# EAGLE design FubarStep_v13 (EAGLE 7.7.0)
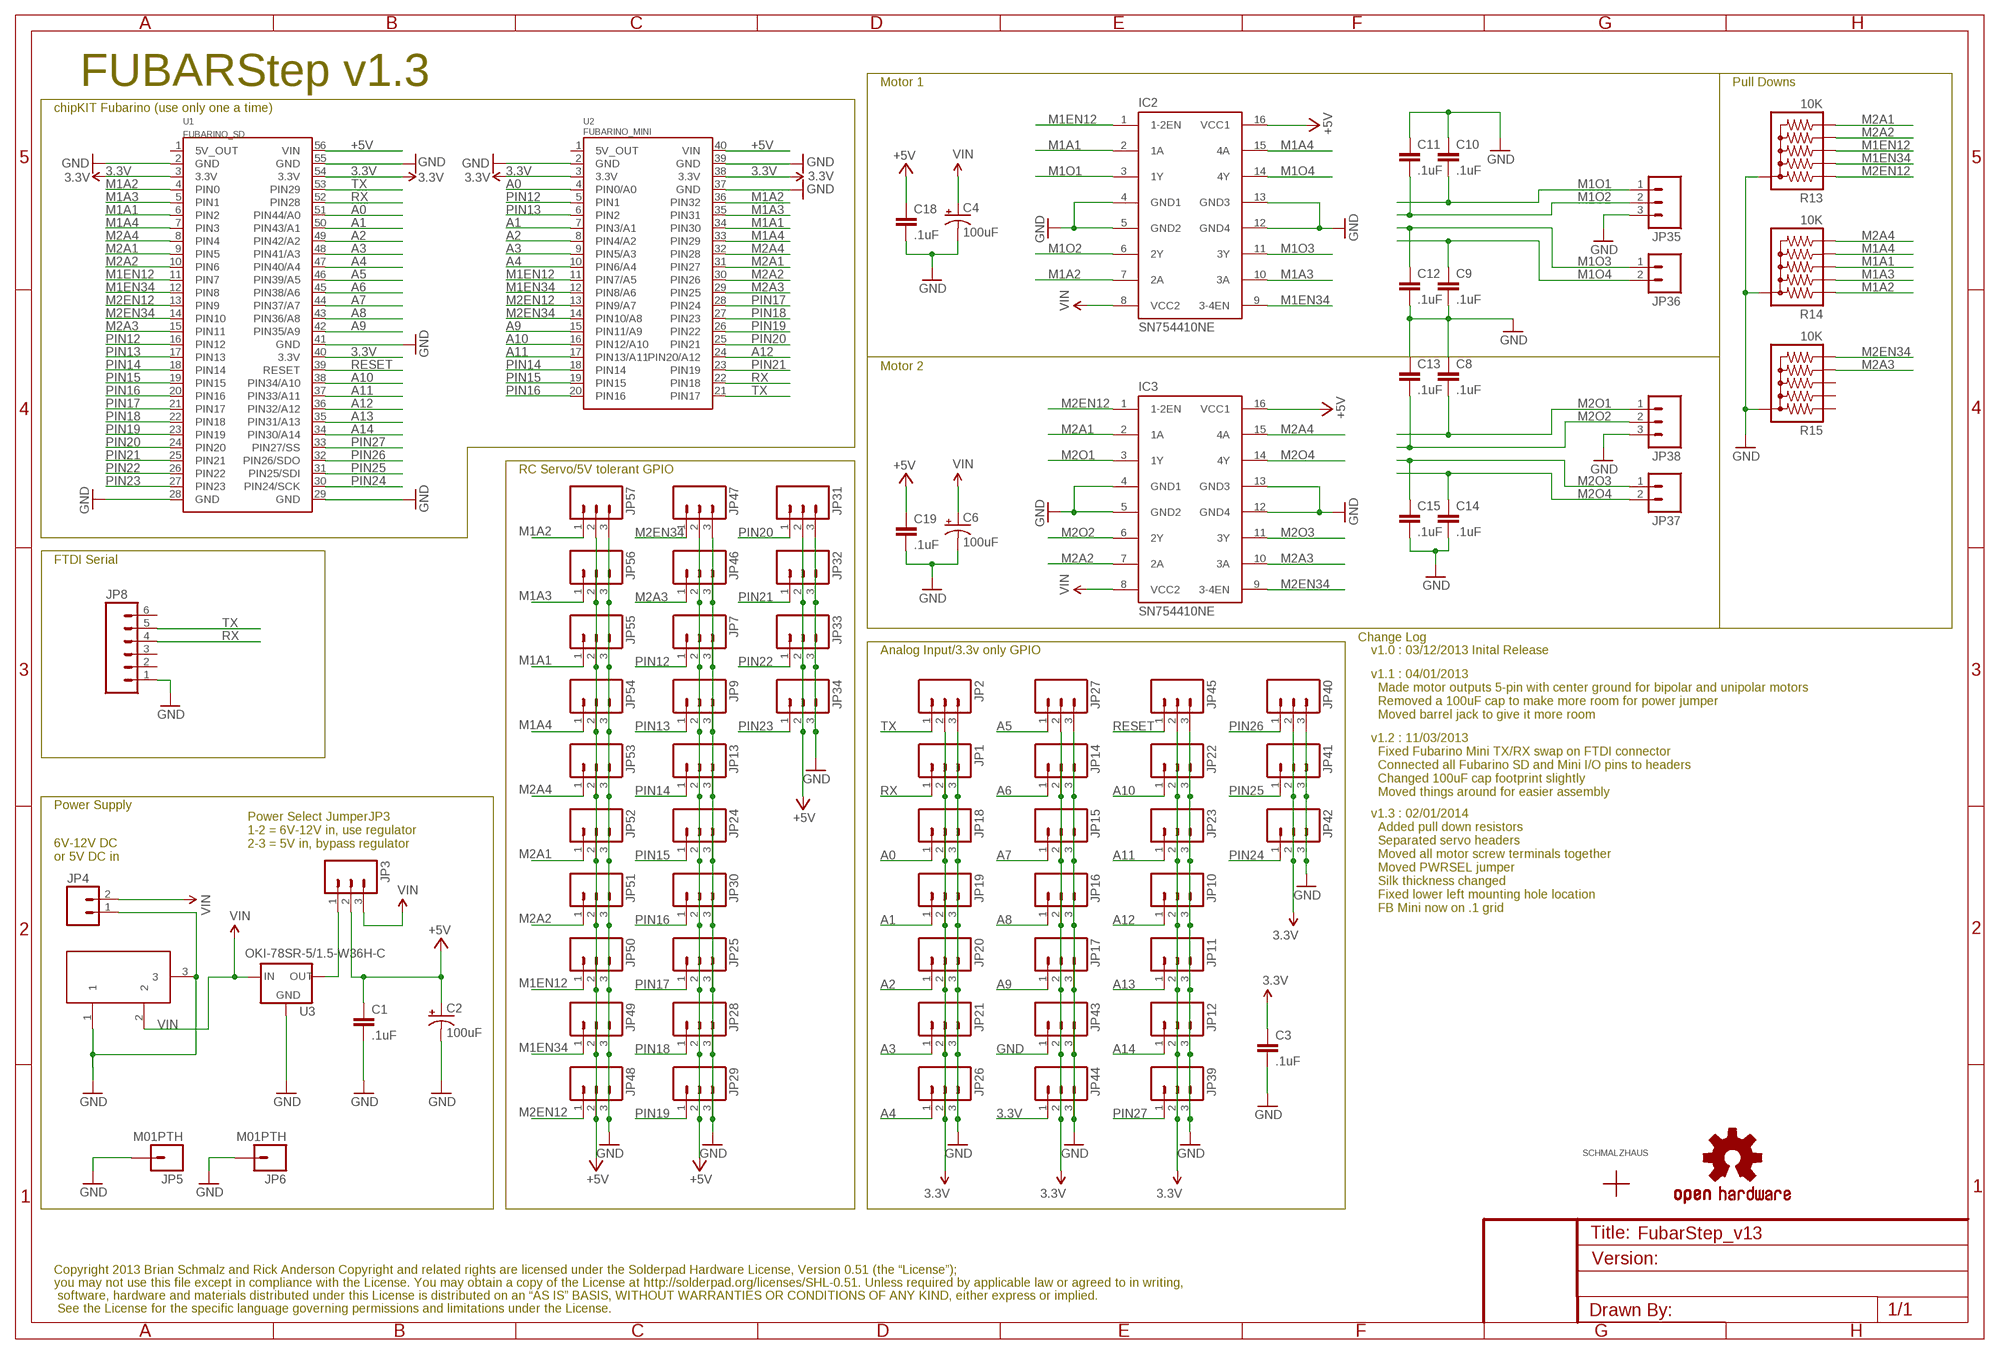
[diagram p0: schematic, sheet 1]

## Parts
C1  .1uF  CAPPTH  [CAP-PTH-SMALL]
C2  100uF  CAP_ELECTROLYTICPTH1_BPS  [CPOL-RADIAL-100UF]
C3  .1uF  CAPPTH  [CAP-PTH-SMALL]
C4  100uF  CAP_ELECTROLYTICPTH1_BPS  [CPOL-RADIAL-100UF]
C6  100uF  CAP_ELECTROLYTICPTH1_BPS  [CPOL-RADIAL-100UF]
C8  .1uF  CAPPTH  [CAP-PTH-SMALL]
C9  .1uF  CAPPTH  [CAP-PTH-SMALL]
C10  .1uF  CAPPTH  [CAP-PTH-SMALL]
C11  .1uF  CAPPTH  [CAP-PTH-SMALL]
C12  .1uF  CAPPTH  [CAP-PTH-SMALL]
C13  .1uF  CAPPTH  [CAP-PTH-SMALL]
C14  .1uF  CAPPTH  [CAP-PTH-SMALL]
C15  .1uF  CAPPTH  [CAP-PTH-SMALL]
C18  .1uF  CAPPTH  [CAP-PTH-SMALL]
C19  .1uF  CAPPTH  [CAP-PTH-SMALL]
IC2  SN754410NE  L293E  [DIL16]
IC3  SN754410NE  L293E  [DIL16]
JP1  M03PTH  [1X03]
JP2  M03PTH  [1X03]
JP3  M03PTH  [1X03]
JP4  M023.5MM  [SCREWTERMINAL-3.5MM-2]
JP5  M01PTH  [1X01]
JP6  M01PTH  [1X01]
JP7  M03PTH  [1X03]
JP8  M06LOCK  [1X06_LOCK]
JP9  M03PTH  [1X03]
JP10  M03PTH  [1X03]
JP11  M03PTH  [1X03]
JP12  M03PTH  [1X03]
JP13  M03PTH  [1X03]
JP14  M03PTH  [1X03]
JP15  M03PTH  [1X03]
JP16  M03PTH  [1X03]
JP17  M03PTH  [1X03]
JP18  M03PTH  [1X03]
JP19  M03PTH  [1X03]
JP20  M03PTH  [1X03]
JP21  M03PTH  [1X03]
JP22  M03PTH  [1X03]
JP23  M03PTH  [1X03]
JP24  M03PTH  [1X03]
JP25  M03PTH  [1X03]
JP26  M03PTH  [1X03]
JP27  M03PTH  [1X03]
JP28  M03PTH  [1X03]
JP29  M03PTH  [1X03]
JP30  M03PTH  [1X03]
JP31  M03PTH  [1X03]
JP32  M03PTH  [1X03]
JP33  M03PTH  [1X03]
JP34  M03PTH  [1X03]
JP35  M03SCREW  [SCREWTERMINAL-3.5MM-3]
JP36  M023.5MM  [SCREWTERMINAL-3.5MM-2]
JP37  M023.5MM  [SCREWTERMINAL-3.5MM-2]
JP38  M03SCREW  [SCREWTERMINAL-3.5MM-3]
JP39  M03PTH  [1X03]
JP40  M03PTH  [1X03]
JP41  M03PTH  [1X03]
JP42  M03PTH  [1X03]
JP43  M03PTH  [1X03]
JP44  M03PTH  [1X03]
JP45  M03PTH  [1X03]
JP46  M03PTH  [1X03]
JP47  M03PTH  [1X03]
JP48  M03PTH  [1X03]
JP49  M03PTH  [1X03]
JP50  M03PTH  [1X03]
JP51  M03PTH  [1X03]
JP52  M03PTH  [1X03]
JP53  M03PTH  [1X03]
JP54  M03PTH  [1X03]
JP55  M03PTH  [1X03]
JP56  M03PTH  [1X03]
JP57  M03PTH  [1X03]
LOGO1  OSHW-LOGOM  [OSHW-LOGO-M]
R13  10K  RPACK-BUSSED-SIP-PTH-5  [RPACK-SIP-PTH-5]
R14  10K  RPACK-BUSSED-SIP-PTH-5  [RPACK-SIP-PTH-5]
R15  10K  RPACK-BUSSED-SIP-PTH-5  [RPACK-SIP-PTH-5]
U1  FUBARINO_SD  [FUBARINO_SD]
U2  FUBARINO_MINI  [FUBARINO_MINI]
U3  OKI-78SR-5/1.5-W36H-C  V_REG_78XXSINK  [TO220-IGO]
U$1  SCHMALZHAUSSCHMALZHAUS_SMALL  [SCHMALZHAUS_SMALL]
X1  DC21MMX  [DC-21MM]

## Nets
3.3V: C3.1 JP1.2 JP2.2 JP10.2 JP11.2 JP12.2 JP14.2 JP15.2 JP16.2 JP17.2 JP18.2 JP19.2 JP20.2 JP21.2 JP22.2 JP23.2 JP26.2 JP27.2 JP39.2 JP40.2 JP41.2 JP42.2 JP43.2 JP44.1 JP44.2 JP45.2 U1.3(3.3V) U1.40(3.3V) U1.54(3.3V) U2.3(3.3V) U2.38(3.3V)
+5V: C1.1 C2.1(+) C18.1 C19.1 IC2.16(VCC1) IC3.16(VCC1) JP3.2 JP7.2 JP9.2 JP13.2 JP24.2 JP25.2 JP28.2 JP29.2 JP30.2 JP31.2 JP32.2 JP33.2 JP34.2 JP46.2 JP47.2 JP48.2 JP49.2 JP50.2 JP51.2 JP52.2 JP53.2 JP54.2 JP55.2 JP56.2 JP57.2 U1.56(VIN) U2.40(VIN)
A0: JP18.1 U1.51(PIN44/A0) U2.4(PIN0/A0)
A1: JP19.1 U1.50(PIN43/A1) U2.7(PIN3/A1)
A2: JP20.1 U1.49(PIN42/A2) U2.8(PIN4/A2)
A3: JP21.1 U1.48(PIN41/A3) U2.9(PIN5/A3)
A4: JP26.1 U1.47(PIN40/A4) U2.10(PIN6/A4)
A5: JP27.1 U1.46(PIN39/A5)
A6: JP14.1 U1.45(PIN38/A6)
A7: JP15.1 U1.44(PIN37/A7)
A8: JP16.1 U1.43(PIN36/A8)
A9: JP17.1 U1.42(PIN35/A9) U2.15(PIN11/A9)
A10: JP22.1 U1.38(PIN34/A10) U2.16(PIN12/A10)
A11: JP23.1 U1.37(PIN33/A11) U2.17(PIN13/A11)
A12: JP10.1 U1.36(PIN32/A12) U2.24(PIN20/A12)
A13: JP11.1 U1.35(PIN31/A13)
A14: JP12.1 U1.34(PIN30/A14)
GND: C1.2 C2.2(-) C3.2 C4.2(-) C6.2(-) C8.1 C9.2 C10.1 C11.1 C12.2 C13.1 C14.2 C15.2 C18.2 C19.2 IC2.4(GND1) IC2.5(GND2) IC2.12(GND4) IC2.13(GND3) IC3.4(GND1) IC3.5(GND2) IC3.12(GND4) IC3.13(GND3) JP1.3 JP2.3 JP4.1 JP5.1 JP6.1 JP7.3 JP8.1 JP9.3 JP10.3 JP11.3 JP12.3 JP13.3 JP14.3 JP15.3 JP16.3 JP17.3 JP18.3 JP19.3 JP20.3 JP21.3 JP22.3 JP23.3 JP24.3 JP25.3 JP26.3 JP27.3 JP28.3 JP29.3 JP30.3 JP31.3 JP32.3 JP33.3 JP34.3 JP35.3 JP38.3 JP39.3 JP40.3 JP41.3 JP42.3 JP43.1 JP43.3 JP44.3 JP45.3 JP46.3 JP47.3 JP48.3 JP49.3 JP50.3 JP51.3 JP52.3 JP53.3 JP54.3 JP55.3 JP56.3 JP57.3 R13.P$1 R14.P$1 R15.P$1 U1.2(GND) U1.28(GND) U1.29(GND) U1.41(GND) U1.55(GND) U2.2(GND) U2.37(GND) U2.39(GND) U3.GND X1.1 X1.3
M1A1: IC2.2(1A) JP55.1 R14.P$4 U1.6(PIN2) U2.34(PIN30)
M1A2: IC2.7(2A) JP57.1 R14.P$2 U1.4(PIN0) U2.36(PIN32)
M1A3: IC2.10(3A) JP56.1 R14.P$3 U1.5(PIN1) U2.35(PIN31)
M1A4: IC2.15(4A) JP54.1 R14.P$5 U1.7(PIN3) U2.33(PIN29)
M1EN12: IC2.1(1-2EN) JP50.1 R13.P$4 U1.11(PIN7) U2.11(PIN7/A5)
M1EN34: IC2.9(3-4EN) JP49.1 R13.P$3 U1.12(PIN8) U2.12(PIN8/A6)
M1O1: C10.2 IC2.3(1Y) JP35.1
M1O2: C11.2 IC2.6(2Y) JP35.2
M1O3: C12.1 IC2.11(3Y) JP36.1
M1O4: C9.1 IC2.14(4Y) JP36.2
M2A1: IC3.2(1A) JP52.1 R13.P$6 U1.9(PIN5) U2.31(PIN27)
M2A2: IC3.7(2A) JP51.1 R13.P$5 U1.10(PIN6) U2.30(PIN26)
M2A3: IC3.10(3A) JP46.1 R15.P$5 U1.15(PIN11) U2.29(PIN25)
M2A4: IC3.15(4A) JP53.1 R14.P$6 U1.8(PIN4) U2.32(PIN28)
M2EN12: IC3.1(1-2EN) JP48.1 R13.P$2 U1.13(PIN9) U2.13(PIN9/A7)
M2EN34: IC3.9(3-4EN) JP47.1 R15.P$6 U1.14(PIN10) U2.14(PIN10/A8)
M2O1: C8.2 IC3.3(1Y) JP38.1
M2O2: C13.2 IC3.6(2Y) JP38.2
M2O3: C15.1 IC3.11(3Y) JP37.1
M2O4: C14.1 IC3.14(4Y) JP37.2
N$2: JP3.1 U3.OUT
PIN12: JP7.1 U1.16(PIN12) U2.5(PIN1)
PIN13: JP9.1 U1.17(PIN13) U2.6(PIN2)
PIN14: JP13.1 U1.18(PIN14) U2.18(PIN14)
PIN15: JP24.1 U1.19(PIN15) U2.19(PIN15)
PIN16: JP30.1 U1.20(PIN16) U2.20(PIN16)
PIN17: JP25.1 U1.21(PIN17) U2.28(PIN24)
PIN18: JP28.1 U1.22(PIN18) U2.27(PIN23)
PIN19: JP29.1 U1.23(PIN19) U2.26(PIN22)
PIN20: JP31.1 U1.24(PIN20) U2.25(PIN21)
PIN21: JP32.1 U1.25(PIN21) U2.23(PIN19)
PIN22: JP33.1 U1.26(PIN22)
PIN23: JP34.1 U1.27(PIN23)
PIN24: JP42.1 U1.30(PIN24/SCK)
PIN25: JP41.1 U1.31(PIN25/SDI)
PIN26: JP40.1 U1.32(PIN26/SDO)
PIN27: JP39.1 U1.33(PIN27/SS)
RESET: JP45.1 U1.39(RESET)
RX: JP1.1 JP8.4 U1.52(PIN28) U2.22(PIN18)
TX: JP2.1 JP8.5 U1.53(PIN29) U2.21(PIN17)
VIN: C4.1(+) C6.1(+) IC2.8(VCC2) IC3.8(VCC2) JP3.3 JP4.2 U3.IN X1.2
Unconnected: JP8.2 JP8.3 JP8.6 R15.P$2 R15.P$3 R15.P$4 U1.1(5V_OUT) U2.1(5V_OUT)

## Notes on the sheet
- FUBARStep v1.3 | Motor 1 | Pull Downs
- chipKIT Fubarino (use only one a time)
- Motor 2
- RC Servo/5V tolerant GPIO
- FTDI Serial
- Change Log
- Analog Input/3.3v only GPIO | v1.0 : 03/12/2013 Inital Release
- v1.1 : 04/01/2013
    Made motor outputs 5-pin with center ground for bipolar and unipolar motors
    Removed a 100uF cap to make more room for power jumper
    Moved barrel jack to give it more room
- v1.2 : 11/03/2013
    Fixed Fubarino Mini TX/RX swap on FTDI connector
    Connected all Fubarino SD and Mini I/O pins to headers
    Changed 100uF cap footprint slightly
    Moved things around for easier assembly
- Power Supply
- Power Select JumperJP3
  1-2 = 6V-12V in, use regulator
  2-3 = 5V in, bypass regulator
- 6V-12V DC 
  or 5V DC in
- v1.3 : 02/01/2014
    Added pull down resistors
    Separated servo headers
    Moved all motor screw terminals together
    Moved PWRSEL jumper
    Silk thickness changed
    Fixed lower left mounting hole location
    FB Mini now on .1 grid
- Copyright 2013 Brian Schmalz and Rick Anderson Copyright and related rights are licensed under the Solderpad Hardware License, Version 0.51 (the “License”);
- you may not use this file except in compliance with the License. You may obtain a copy of the License at http://solderpad.org/licenses/SHL-0.51. Unless required by applicable law or agreed to in writing,
- software, hardware and materials distributed under this License is distributed on an “AS IS” BASIS, WITHOUT WARRANTIES OR CONDITIONS OF ANY KIND, either express or implied.
- See the License for the specific language governing permissions and limitations under the License.

## Library data of the parts
C1 C3 C8-C15 C18 C19 = SparkFun-Capacitors:CAP: Capacitor Standard 0603 ceramic capacitor, and 0.1" leaded capacitor.
C2 C4 C6 = SchmalzHaus:CAP_ELECTROLYTIC
IC2 IC3 = texas:L293E: TI DEVICE; MF: Arrow Electronics; MPN: L293E; OC_FARNELL: 1467711; OC_NEWARK: 89K0732
JP1-JP3 JP7 JP9-JP35 JP38-JP57 = SparkFun-Connectors:M03: Header 3 Standard 3-pin 0.1" header. Use with straight break away headers (SKU : PRT-00116), right angle break away headers (PRT-00553), swiss pins (PRT-00743), machine pins (PRT-00117), and female headers (PRT-00115). Molex polarized connector foot print use with SKU : PRT-08232 with associated crimp pins and housings.
JP4 JP36 JP37 = SparkFun-Connectors:M02: Header 2 Standard 2-pin 0.1" header. Use with straight break away headers (SKU : PRT-00116), right angle break away headers (PRT-00553), swiss pins (PRT-00743), machine pins (PRT-00117), and female headers (PRT-00115). Molex polarized connector foot print use with SKU : PRT-08233 with associated crimp pins and housings.
JP5 JP6 = SparkFun-Connectors:M01: Header 1 Standard 1-pin 0.1" header. Use with straight break away headers (SKU : PRT-00116), right angle break away headers (PRT-00553), swiss pins (PRT-00743), machine pins (PRT-00117), and female headers (PRT-00115).
JP8 = SparkFun-Connectors:M06: Header 6 Standard 6-pin 0.1" header. Use with straight break away headers (SKU : PRT-00116), right angle break away headers (PRT-00553), swiss pins (PRT-00743), machine pins (PRT-00117), and female headers (PRT-00115). Molex polarized connector foot print use with SKU : PRT-08094 with associated crimp pins and housings. NOTES ON THE VARIANTS LOCK and LOCK_LONGPADS... This footprint was designed to help hold the alignment of a through-hole component (i.e. 6-pin header) while soldering it into place. You may notice that each hole has been shifted either up or down by 0.005 of an inch from it's more standard position (which is a perfectly straight line). This slight alteration caused the pins (the squares in the middle) to touch the edges of the holes. Because they are alternating, it causes a "brace" to hold the component in place. 0.005 has proven to be the perfect amount of "off-center" position when using our standard breakaway headers. Although looks a little odd when you look at the bare footprint, once you have a header in there, the alteration is very hard to notice. Also, if you push a header all the way into place, it is covered up entirely on the bottom side. This idea of altering the position of holes to aid alignment will be further integrated into the Sparkfun Library for other footprints. It can help hold any component with 3 or more connection pins.
LOGO1 = SparkFun-Aesthetics:OSHW-LOGO: Open Source Hardware Logo This logo indicates the piece of hardware it is found on incorporates a OSHW license and/or adheres to the definition of open source hardware found here: http://freedomdefined.org/OSHW
R13-R15 = SparkFun-Resistors:RPACK: BOURNS 4600X series thick-film SIP resistor packs Five resistors bussed to a single pin (denoted by dot). 0.2W / resistor datasheet <http://dlnmh9ip6v2uc.cloudfront.net/datasheets/Components/General/4600x.pdf> SFE parts COM-10855 (330), COM-10856 (10K)
U1 = SchmalzHausPublic:FUBARINO_SD
U2 = SchmalzHausPublic:FUBARINO_MINI
U3 = SparkFun-PowerIC:V_REG_78XX: Voltage Regulator Standard 7805 5V regulator. IGO (Input Ground Output). Spark Fun Electronics SKU : COM-00107
U$1 = SchmalzHaus:SCHMALZHAUS
X1 = powersupply:DC21MM

## Net classes
0 default: width 0.152 mm, drill 0.305 mm, clearance 0.152 mm

## Board
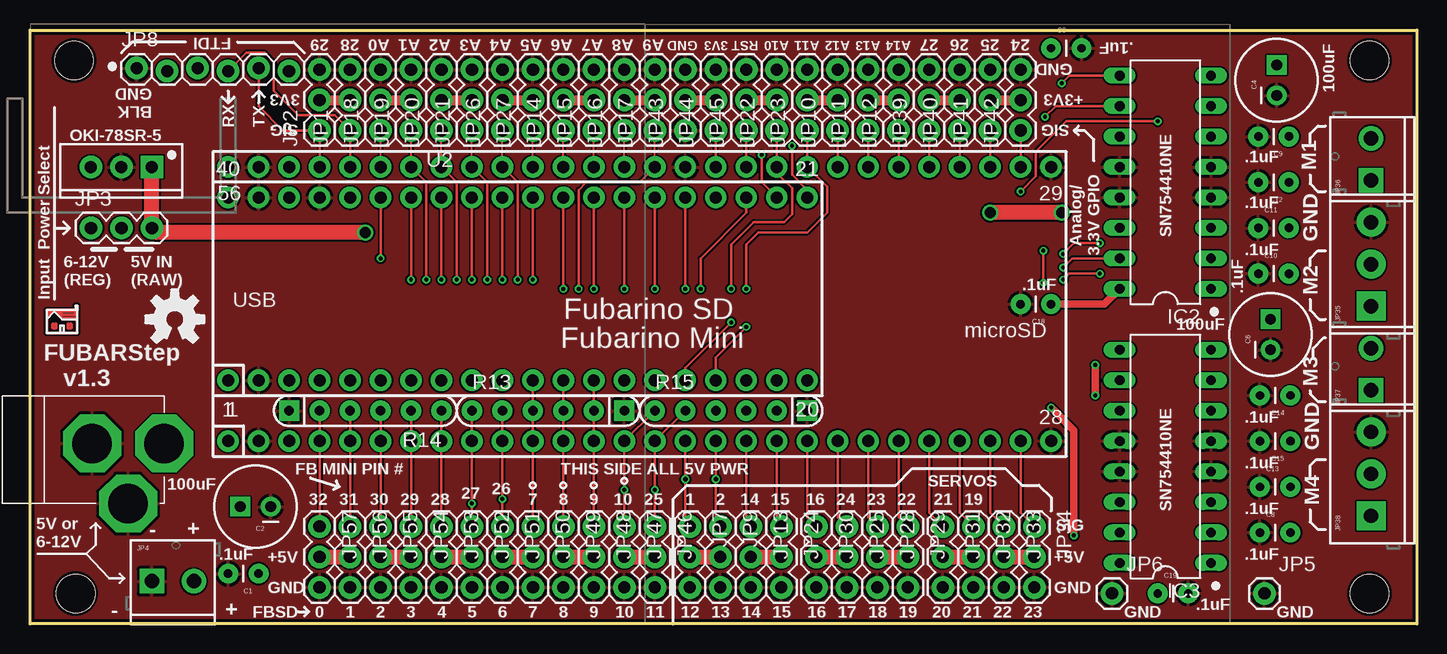
[diagram p1: board, top side]
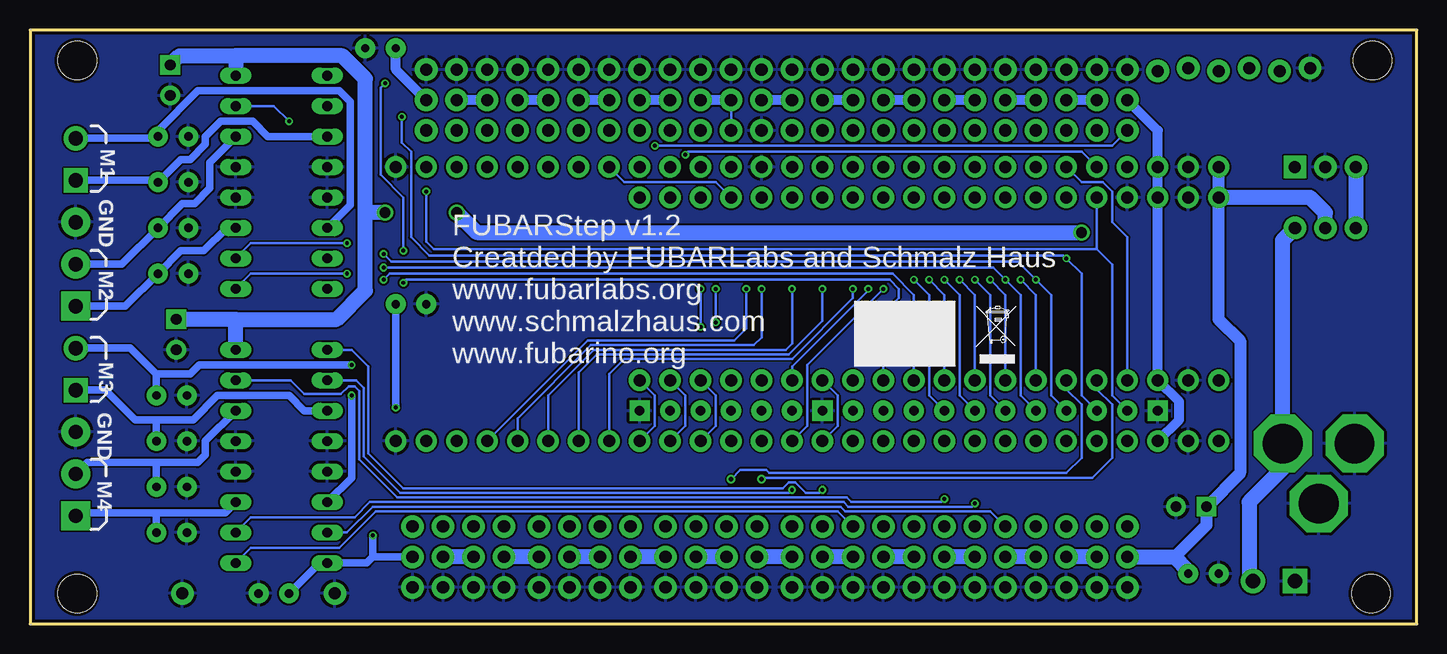
[diagram p2: board, bottom side, seen from below]

Size 115.57 x 49.53 mm. Coordinates in mm from the lower left corner, seen from the top.
Outline: 0,49.53 115.57,49.53 115.57,0 0,0 0,49.53
Copper layers (1*16): Top 0.035mm / dielectric 1.5mm / Bottom 0.035mm
Design rules "Fusion_eagle_rule_v1.1 *": minimum track width 6mil, minimum drill 12mil, track to track 6mil, track to pad 6mil, pad to pad 6mil, via to via 6mil, smd to smd 0mil, copper to edge 10mil, drill to drill 10mil, minimum pad ring 10mil, minimum via ring 6mil, stop-mask expansion 2mil, vias tented up to drill 100mil, thermal gap 10mil
Holes 3.2 mm at 111.63,46.99 111.63,2.54 3.68,46.99 3.81,2.54

### Footprints (pad centres in the part's own frame; a part is rotated, then mirrored left to right if it is on the bottom)
CAP-PTH-SMALL = drill 0.7 pad 1.651: 1 0,0; 2 2.54,0
CPOL-RADIAL-100UF = drill 0.9 pad 1.651 square: 1 1.27,0 | drill 0.9 pad 1.651: 2 -1.27,0
DIL16 = drill 0.813 long: 1 -8.89,-3.81; 2 -6.35,-3.81; 3 -3.81,-3.81; 4 -1.27,-3.81; 5 1.27,-3.81; 6 3.81,-3.81; 7 6.35,-3.81; 8 8.89,-3.81; 9 8.89,3.81; 10 6.35,3.81; 11 3.81,3.81; 12 1.27,3.81; 13 -1.27,3.81; 14 -3.81,3.81; 15 -6.35,3.81; 16 -8.89,3.81
1X03 = drill 1.016 pad 1.88: 1 0,0; 2 2.54,0; 3 5.08,0
SCREWTERMINAL-3.5MM-2 = drill 1.2 pad 2.032 square: 1 0,0 | drill 1.2 pad 2.032: 2 3.5,0
1X01 = drill 1.016 pad 1.88: 1 0,0
1X06_LOCK = drill 1.016 pad 1.88: 1 0,0; 2 2.54,-0.254; 3 5.08,0; 4 7.62,-0.254; 5 10.16,0; 6 12.7,-0.254
SCREWTERMINAL-3.5MM-3 = drill 1.2 pad 2.413 square: 1 0,0 | drill 1.2 pad 2.413: 2 3.5,0; 3 7,0
RPACK-SIP-PTH-5 = drill 0.8 pad 1.676 square: P$1 0,0 | drill 0.8 pad 1.676: P$2 0,-2.54; P$3 0,-5.08; P$4 0,-7.62; P$5 0,-10.16; P$6 0,-12.7
FUBARINO_SD = drill 1 pad 1.778: 1 -34.29,-11.43; 2 -31.75,-11.43; 3 -29.21,-11.43; 4 -26.67,-11.43; 5 -24.13,-11.43; 6 -21.59,-11.43; 7 -19.05,-11.43; 8 -16.51,-11.43; 9 -13.97,-11.43; 10 -11.43,-11.43; 11 -8.89,-11.43; 12 -6.35,-11.43; 13 -3.81,-11.43; 14 -1.27,-11.43; 15 1.27,-11.43; 16 3.81,-11.43; 17 6.35,-11.43; 18 8.89,-11.43; 19 11.43,-11.43; 20 13.97,-11.43; 21 16.51,-11.43; 22 19.05,-11.43; 23 21.59,-11.43; 24 24.13,-11.43; 25 26.67,-11.43; 26 29.21,-11.43; 27 31.75,-11.43; 28 34.29,-11.43; 29 34.29,11.43; 30 31.75,11.43; 31 29.21,11.43; 32 26.67,11.43; 33 24.13,11.43; 34 21.59,11.43; 35 19.05,11.43; 36 16.51,11.43; 37 13.97,11.43; 38 11.43,11.43; 39 8.89,11.43; 40 6.35,11.43; 41 3.81,11.43; 42 1.27,11.43; 43 -1.27,11.43; 44 -3.81,11.43; 45 -6.35,11.43; 46 -8.89,11.43; 47 -11.43,11.43; 48 -13.97,11.43; 49 -16.51,11.43; 50 -19.05,11.43; 51 -21.59,11.43; 52 -24.13,11.43; 53 -26.67,11.43; 54 -29.21,11.43; 55 -31.75,11.43; 56 -34.29,11.43
FUBARINO_MINI = drill 1 pad 1.778: 1 -24.13,-7.62; 2 -21.59,-7.62; 3 -19.05,-7.62; 4 -16.51,-7.62; 5 -13.97,-7.62; 6 -11.43,-7.62; 7 -8.89,-7.62; 8 -6.35,-7.62; 9 -3.81,-7.62; 10 -1.27,-7.62; 11 1.27,-7.62; 12 3.81,-7.62; 13 6.35,-7.62; 14 8.89,-7.62; 15 11.43,-7.62; 16 13.97,-7.62; 17 16.51,-7.62; 18 19.05,-7.62; 19 21.59,-7.62; 20 24.13,-7.62; 21 24.13,7.62; 22 21.59,7.62; 23 19.05,7.62; 24 16.51,7.62; 25 13.97,7.62; 26 11.43,7.62; 27 8.89,7.62; 28 6.35,7.62; 29 3.81,7.62; 30 1.27,7.62; 31 -1.27,7.62; 32 -3.81,7.62; 33 -6.35,7.62; 34 -8.89,7.62; 35 -11.43,7.62; 36 -13.97,7.62; 37 -16.51,7.62; 38 -19.05,7.62; 39 -21.59,7.62; 40 -24.13,7.62
TO220-IGO = drill 1 pad 1.88: GND 0,0; OUT 2.54,0 | drill 1 pad 1.88 square: IN -2.54,0
DC-21MM = drill 3.302 pad 4.826 octagon: 1 -5.08,-3.353; 2 -0.076,-6.35; 3 -0.076,-0.356

### Placement (x,y rotation side)
C1  19.05,4.19 180 top
C2  18.8,9.78 180 top
C3  85.09,48.01 0 top
C4  103.89,45.34 90 top
C6  103.38,24.13 90 top
C8  102.49,7.62 0 top
C9  104.9,40.64 180 top
C10  102.36,29.21 0 top
C11  102.36,33.02 0 top
C12  104.9,36.83 180 top
C13  102.49,11.43 0 top
C14  105.03,19.05 180 top
C15  105.03,15.24 180 top
C18  85.09,26.67 180 top
C19  93.98,2.54 0 top
IC2  94.61,36.83 90 top
IC3  94.61,13.97 90 top
JP1  26.67,41.15 90 top
JP2  24.13,41.15 90 top
JP3  5.08,33.02 0 top
JP4  10.16,3.56 0 top
JP5  102.87,2.54 0 top
JP6  90.17,2.54 0 top
JP7  54.99,8.13 270 top
JP8  8.89,46.35 0 top
JP9  57.53,8.13 270 top
JP10  67.31,41.15 90 top
JP11  69.85,41.15 90 top
JP12  72.39,41.15 90 top
JP13  60.07,8.13 270 top
JP14  44.45,41.15 90 top
JP15  46.99,41.15 90 top
JP16  49.53,41.15 90 top
JP17  52.07,41.15 90 top
JP18  29.21,41.15 90 top
JP19  31.75,41.15 90 top
JP20  34.29,41.15 90 top
JP21  36.83,41.15 90 top
JP22  62.23,41.15 90 top
JP23  64.77,41.15 90 top
JP24  62.61,8.13 270 top
JP25  68.07,8.13 270 top
JP26  39.37,41.15 90 top
JP27  41.91,41.15 90 top
JP28  70.61,8.13 270 top
JP29  73.15,8.13 270 top
JP30  65.53,8.13 270 top
JP31  76.07,8.13 270 top
JP32  78.61,8.13 270 top
JP33  81.15,8.13 270 top
JP34  83.69,8.13 270 top
JP35  111.76,26.5 90 top
JP36  111.76,37 90 top
JP37  111.76,19.5 90 top
JP38  111.76,9.01 90 top
JP39  74.93,41.15 90 top
JP40  77.47,41.15 90 top
JP41  80.01,41.15 90 top
JP42  82.55,41.15 90 top
JP43  54.61,41.15 90 top
JP44  57.15,41.15 90 top
JP45  59.69,41.15 90 top
JP46  52.07,8.13 270 top
JP47  49.53,8.13 270 top
JP48  46.99,8.13 270 top
JP49  44.45,8.13 270 top
JP50  41.91,8.13 270 top
JP51  39.37,8.13 270 top
JP52  36.83,8.13 270 top
JP53  34.29,8.13 270 top
JP54  31.75,8.13 270 top
JP55  29.21,8.13 270 top
JP56  26.67,8.13 270 top
JP57  24.13,8.13 270 top
LOGO1  12.06,25.4 0 top
R13  49.53,17.78 270 top
R14  21.59,17.78 90 top
R15  64.77,17.78 270 top
U1  50.8,26.67 0 top
U2  40.64,27.94 0 top
U3  7.62,38.1 180 top
U$1  2.67,24.26 0 top
U$2  [ROHS_GARBAGE_5MM]  36.7,21.72 0 bottom
U$3  [CE_5MM]  42.8,24.26 0 bottom
X1  4.83,15.11 90 top

### Tracks (layer width: path | path; a pad name or v marks a point on that pad's centre or on a via)
3.3V
  Top 0.203: U1.40 JP44.1
  Top 0.813: JP2.2 JP1.2 | JP18.2 JP19.2 | JP20.2 JP21.2 | JP26.2 JP27.2 | JP14.2 JP15.2 | JP16.2 JP17.2 | JP43.2 JP44.2 | JP45.2 JP22.2 | JP23.2 JP10.2 | JP11.2 JP12.2 | JP39.2 JP40.2 | JP41.2 JP42.2
  Bottom 0.203: JP44.2 JP44.1
  Bottom 0.813: U1.3 19.81,17.02 19.81,18.54 U2.3 U2.38 U1.54 21.59,41.15 JP2.2 | JP1.2 JP18.2 | JP19.2 JP20.2 | JP21.2 JP26.2 | JP27.2 JP14.2 | JP15.2 JP16.2 | JP17.2 JP43.2 | JP44.2 JP45.2 | JP22.2 JP23.2 | JP10.2 JP11.2 | JP12.2 JP39.2 | JP40.2 JP41.2 | JP42.2 85.09,46.23 C3.1
+5V  (via drill 0.33)
  Top 0.61: C18.1 89.53,26.67 IC2.16 | v85.09,18.03 87,16.13 v87,7.37
  Top 1.27: JP57.2 JP56.2 | JP55.2 JP54.2 | JP53.2 JP52.2 | JP51.2 JP50.2 | JP49.2 JP48.2 | JP47.2 JP46.2 | JP7.2 JP9.2 | JP13.2 JP24.2 | JP30.2 JP25.2 | JP28.2 JP29.2 | JP31.2 JP32.2 | JP33.2 JP34.2
  Bottom 0.203: 85.09,18.29 v85.09,18.03
  Bottom 0.61: 87,5.59 87.5,5.08 IC3.16 91.44,5.08 C19.1 | 85.09,18.29 C18.1 | JP34.2 87,5.59 | v87,7.37 87,5.59
  Bottom 1.016: U1.56 U2.40 16.51,25.4 14.73,23.62 14.73,12.57 C2.1 17.53,8.26 20.19,5.59
  Bottom 1.27: JP56.2 JP55.2 | JP54.2 JP53.2 | JP52.2 JP51.2 | JP50.2 JP49.2 | JP48.2 JP47.2 | JP46.2 JP7.2 | JP9.2 JP13.2 | JP24.2 JP30.2 | JP25.2 JP28.2 | JP29.2 JP31.2 | JP32.2 JP33.2 | JP3.2 7.62,34.29 8.89,35.56 U2.40 | JP57.2 20.19,5.59 19.05,4.45 C1.1
A0
  Top 0.152: U1.51 JP18.1
  Bottom 0.203: U2.4 24.13,32.26 25.4,33.53 25.4,36.07 26.16,36.83 27.94,36.83 U1.51
A1  (via drill 0.33)
  Top 0.152: U1.50 JP19.1
  Top 0.203: v33.02,28.7 33.02,36.83 U1.50
  Bottom 0.203: U2.7 31.75,27.43 v33.02,28.7
A2  (via drill 0.33)
  Top 0.152: U1.49 JP20.1
  Top 0.203: v35.56,28.7 35.56,36.83 U1.49
  Bottom 0.203: U2.8 34.29,27.43 v35.56,28.7
A3  (via drill 0.33)
  Top 0.152: U1.48 JP21.1
  Top 0.203: v38.1,28.7 38.1,36.83 U1.48
  Bottom 0.203: U2.9 36.83,27.43 v38.1,28.7
A4  (via drill 0.33)
  Top 0.152: U1.47 JP26.1
  Top 0.203: v40.64,28.7 40.64,36.83 U1.47
  Bottom 0.203: U2.10 39.37,27.43 v40.64,28.7
A5
  Top 0.152: U1.46 JP27.1
A6
  Top 0.152: U1.45 JP14.1
A7
  Top 0.152: U1.44 JP15.1
A8
  Top 0.152: U1.43 JP16.1
A9  (via drill 0.33)
  Top 0.152: U1.42 JP17.1
  Top 0.203: v45.72,27.94 45.72,36.2 46.35,36.83 50.8,36.83 U1.42
  Bottom 0.203: U2.15 52.07,21.46 45.72,27.81 v45.72,27.94
A10  (via drill 0.33)
  Top 0.203: U2.16 54.61,21.34 v58.42,25.15 | v58.42,27.94 58.42,31.62 60.33,33.53 62.87,33.53 63.5,34.16 63.5,36.32 62.23,37.59 U1.38 JP22.1
  Bottom 0.203: v58.42,25.15 v58.42,27.94
A11  (via drill 0.33)
  Top 0.203: U2.17 57.15,22.23 v59.69,24.77 | v59.69,27.94 59.69,31.62 60.71,32.64 64.77,32.64 66.42,34.29 66.42,36.45 U1.37 JP23.1
  Bottom 0.203: v59.69,24.77 v59.69,27.94
A12
  Top 0.203: JP10.1 U1.36
  Bottom 0.203: U2.24 58.42,36.83 66.04,36.83 U1.36
A13
  Top 0.203: JP11.1 U1.35
A14
  Top 0.203: JP12.1 U1.34
GND
  pour Bottom (rank 2): 0,49.53 115.57,49.53 115.57,0 0,0
  pour Top (rank 2): 0,49.53 115.57,49.53 115.57,0 0,0
M1A1  (via drill 0.33)
  Top 0.203: v89.15,31.75 87,31.75 v86.11,30.86 | U2.34 v31.75,28.7 | JP55.1 U1.6 R14.P$4
  Bottom 0.203: IC2.2 97.16,31.75 v89.15,31.75 | v86.11,30.86 85.47,30.23 33.27,30.23 v31.75,28.7 30.48,27.43 30.48,19.05 R14.P$4
M1A2  (via drill 0.33)
  Top 0.203: v93.98,41.91 86.36,41.91 83.82,39.37 83.82,37.34 v82.55,36.07 | JP57.1 U1.4 R14.P$2
  Bottom 0.203: IC2.7 95.25,43.18 v93.98,41.91 | v82.55,36.07 82.55,31.88 81.92,31.24 26.67,31.24 | 26.67,31.24 25.4,29.97 25.4,19.05 R14.P$2 | 26.67,31.24 U2.36
M1A3  (via drill 0.33)
  Top 0.203: IC2.10 85.47,43.18 v84.58,42.29 | U2.35 v29.21,30.48 | JP56.1 U1.5 R14.P$3
  Bottom 0.203: v84.58,42.29 84.58,40.13 83.82,39.37 83.82,32.26 82.3,30.73 29.46,30.73 v29.21,30.48 27.94,29.21 27.94,19.05 R14.P$3
M1A4  (via drill 0.33)
  Top 0.203: IC2.15 86.87,30.48 v86.11,29.72 | U2.33 v34.29,28.7 | JP54.1 U1.7 R14.P$5
  Bottom 0.203: v86.11,29.72 35.31,29.72 v34.29,28.7 33.02,27.43 33.02,19.05 R14.P$5
M1EN12  (via drill 0.33)
  Top 0.203: v89.15,29.21 86.61,29.21 v86.11,28.7 | JP50.1 U1.11 R13.P$4 U2.11
  Bottom 0.203: IC2.1 97.16,29.21 v89.15,29.21 | v86.11,28.7 85.6,29.21 43.69,29.21 41.91,27.43 U2.11
M1EN34  (via drill 0.33)
  Top 0.203: IC2.9 86.61,45.72 v85.98,45.09 | JP49.1 U1.12 R13.P$3 U2.12 | v84.45,31.11 v84.45,28.45
  Bottom 0.203: v85.98,45.09 86.36,44.7 86.36,37.47 84.45,35.56 v84.45,31.11 | U2.12 44.45,25.91 43.18,27.18 43.18,27.94 43.94,28.7 84.2,28.7 v84.45,28.45
M1O1
  Bottom 0.61: IC2.3 99.19,33.02 101.09,31.11 103,31.11 C10.2 107.61,26.5 JP35.1
M1O2
  Bottom 0.61: IC2.6 100.58,38.48 100.58,36.32 101.85,35.05 102.87,35.05 C11.2 107.92,30 JP35.2
M1O3
  Bottom 0.61: IC2.11 95.76,40.64 97.03,41.91 99.69,41.91 100.97,40.64 100.97,40.01 102.23,38.73 103,38.73 C12.1 105.07,37 JP36.1
M1O4
  Bottom 0.61: IC2.14 88.9,34.92 88.9,43.56 89.79,44.45 101.6,44.45 104.9,41.15 C9.1 105.04,40.5 JP36.2
M2A1  (via drill 0.33)
  Top 0.203: U2.31 v39.37,28.7 | JP52.1 v36.83,10.03 U1.9 R13.P$6
  Bottom 0.203: IC3.2 97.16,8.89 88.52,8.89 87.25,10.16 47.75,10.16 47.37,9.78 37.08,9.78 v36.83,10.03 | v39.37,28.7 38.1,27.43 38.1,19.05 R13.P$6
M2A2  (via drill 0.33)
  Top 0.203: U2.30 v41.91,28.7 | JP51.1 v39.37,10.41 U1.10 R13.P$5
  Bottom 0.203: IC3.7 93.85,20.32 92.71,19.18 89.66,19.18 89.03,19.81 88.52,19.81 88.14,19.43 88.14,13.72 84.96,10.54 47.5,10.54 47.12,10.16 39.62,10.16 v39.37,10.41 | v41.91,28.7 40.64,27.43 40.64,19.05 R13.P$5
M2A3  (via drill 0.33)
  Top 0.203: v44.45,27.94 U2.29 | JP46.1 v52.07,11.18 U1.15 R15.P$5
  Bottom 0.203: v52.07,11.18 52.32,10.92 84.71,10.92 87.76,13.97 87.76,19.68 88.39,20.32 IC3.10 | U1.15 50.8,16.51 50.8,21.59 v44.45,27.94
M2A4  (via drill 0.33)
  Top 0.203: U2.32 v36.83,28.7 | JP53.1 U1.8 R14.P$6
  Bottom 0.203: IC3.15 89.15,7.62 87,9.78 48.01,9.78 47.62,9.4 35.56,9.4 JP53.1 | v36.83,28.7 35.56,27.43 35.56,19.05 R14.P$6
M2EN12
  Top 0.203: JP48.1 U1.13 R13.P$2 U2.13
  Bottom 0.203: IC3.1 97.16,6.35 89.79,6.35 86.74,9.4 48.26,9.4 JP48.1
M2EN34  (via drill 0.33)
  Top 0.203: JP47.1 v49.53,11.18 U1.14 R15.P$6
  Bottom 0.203: v49.53,11.18 49.78,10.92 50.93,10.92 51.82,11.81 52.32,11.81 52.83,11.3 84.45,11.3 87.38,14.22 87.38,21.46 88.77,22.86 IC3.9 | U2.14 48.26,19.05 48.26,16.51 U1.14
M2O1
  Bottom 0.61: IC3.3 99.31,9.27 105.03,9.27 | C8.2 105.03,9.27 | 105.03,9.27 111.5,9.27 JP38.1
M2O2
  Bottom 0.61: IC3.6 100.97,15.24 100.97,14.1 101.6,13.46 105.03,13.46 | 111.7,12.56 JP38.2 110.81,13.46 105.03,13.46 | C13.2 105.03,13.46
M2O3
  Bottom 0.61: IC3.11 92.71,17.78 93.98,19.05 99.95,19.05 101.98,17.02 105.16,17.02 | JP37.1 109.29,19.5 106.81,17.02 105.16,17.02 | C15.1 105.03,16.89 105.16,17.02
M2O4  (via drill 0.33)
  Top 0.61: v88.77,21.59 v88.77,19.05
  Bottom 0.61: v88.77,21.59 101.47,21.59 102.23,20.83 105.03,20.83 | C14.1 105.03,20.83 | v88.77,19.05 88.77,12.19 IC3.14 | JP37.2 107.2,23 105.03,20.83
N$2
  Bottom 1.27: U3.OUT JP3.1
PIN12  (via drill 0.38)
  Top 0.203: JP7.1 54.61,8.51 v54.61,12.06 U1.16
  Bottom 0.203: U2.5 26.67,19.56 25.4,18.29 25.4,13.84 27.05,12.19 54.48,12.19 v54.61,12.06
PIN13  (via drill 0.38)
  Top 0.203: U1.17 v57.15,12.06 57.15,8.51 JP9.1
  Bottom 0.203: U2.6 29.21,19.56 27.94,18.29 27.94,13.84 29.21,12.57 53.98,12.57 54.23,12.83 56.39,12.83 v57.15,12.06
PIN14
  Top 0.203: U1.18 59.69,8.51 JP13.1
  Bottom 0.203: U2.18 58.42,19.05 58.42,16.51 U1.18
PIN15
  Top 0.203: U1.19 62.23,8.51 JP24.1
  Bottom 0.203: U2.19 60.96,19.05 60.96,16.51 U1.19
PIN16
  Top 0.203: U1.20 64.77,8.89 JP30.1
  Bottom 0.203: U2.20 63.5,19.05 63.5,16.51 U1.20
PIN17  (via drill 0.33)
  Top 0.203: U2.28 v46.99,27.94 | U1.21 67.31,8.89 JP25.1
  Bottom 0.203: v46.99,27.94 46.99,27.18 52.07,22.1 53.34,22.1 66.04,22.1 67.31,20.83 U1.21
PIN18  (via drill 0.33)
  Top 0.203: U2.27 v49.53,27.94 | U1.22 69.85,8.89 JP28.1
  Bottom 0.203: v49.53,27.94 49.53,25.27 52.32,22.48 68.33,22.48 69.85,20.95 U1.22
PIN19  (via drill 0.33)
  Top 0.203: U2.26 v52.07,27.94 | U1.23 72.39,8.89 JP29.1
  Bottom 0.203: v52.07,27.94 52.07,23.37 52.58,22.86 68.58,22.86 72.39,19.05 U1.23
PIN20  (via drill 0.33)
  Top 0.203: U2.25 v54.61,27.94 | U1.24 74.93,9.27 JP31.1
  Bottom 0.203: v54.61,27.94 54.61,23.88 55.24,23.24 68.83,23.24 74.93,17.14 U1.24
PIN21  (via drill 0.33)
  Top 0.203: U2.23 59.69,34.29 55.88,30.48 v55.88,27.94 | U1.25 77.47,9.27 JP32.1
  Bottom 0.203: v55.88,27.94 55.88,24.64 56.9,23.62 69.09,23.62 U1.25
PIN22
  Top 0.203: U1.26 80.01,9.27 JP33.1
PIN23
  Top 0.203: U1.27 82.55,9.27 JP34.1
PIN24
  Top 0.203: JP42.1 U1.30
PIN25
  Top 0.203: JP41.1 U1.31
PIN26
  Top 0.203: JP40.1 U1.32
PIN27
  Top 0.203: JP39.1 U1.33
RESET
  Top 0.203: U1.39 JP45.1
RX  (via drill 0.33)
  Top 0.203: U1.52 JP1.1 25.4,42.42 22.35,42.42 20.32,44.45 20.32,46.86 19.56,47.62 18.03,47.62 JP8.4 | U2.22 60.96,36.83 v60.96,39.12
  Bottom 0.203: v60.96,39.12 60.71,39.37 27.94,39.37 U1.52
TX  (via drill 0.33)
  Top 0.203: U1.53 JP2.1 21.08,41.15 19.05,43.18 JP8.5 | U2.21 64.77,36.2 63.5,37.47 v63.5,39.88
  Bottom 0.203: v63.5,39.88 25.4,39.88 JP2.1
VIN  (via drill 0.9)
  Top 1.27: v27.94,32.64 10.54,32.64 JP3.3 U3.IN | v85.98,34.29 v80.01,34.29
  Bottom 0.406: 98.55,47.37 98.42,47.24
  Bottom 1.27: 98.42,25.4 90.02,25.4 87.63,27.79 87.63,34.29 | v85.98,34.29 87.63,34.29 | 87.63,34.29 87.63,45.47 89.53,47.37 98.55,47.37 103.12,47.37 C4.1 | IC3.8 98.42,25.4 | JP4.2 13.97,3.87 13.97,10.16 11.18,12.95 X1.2 11.18,32 JP3.3 | v80.01,34.29 78.36,32.64 v27.94,32.64 | 98.42,47.24 IC2.8 | 98.42,25.4 C6.1

### Text on the board
tPlace: FTDI | 29 | 28 | A0 | A1 | A2 | A3 | A4 | A5 | A6 | A7 | A8 | A9 | GND | 3V3 | RST | A10 | A11 | A12 | A13 | A14 | 27 | 26 | 25 | 24 | .1uF | GND | BLK / GND | 3V3 | +3V3 | 100uF | SIG | SIG | RX | TX | OKI-78SR-5 | .1uF | M1 | .1uF | SN754410NE | GND | Analog/ / 3.3V GPIO | .1uF | 6-12V / (REG) | 5V IN / (RAW) | .1uF | .1uF | Input Power Select | M2 | 100uF | Fubarino Mini | FUBARStep / v1.3 | M3 | .1uF | GND | .1uF | FB MINI PIN # | THIS SIDE ALL 5V PWR | 100uF | 26 | SERVOS | 32 | 31 | 30 | 29 | 28 | 27 | 7 | 8 | 9 | 10 | 25 | 1 | 2 | 14 | 15 | 16 | 24 | 23 | 22 | 21 | 19 | M4 | SN754410NE | .1uF | SIG | - | + | 5V or / 6-12V | .1uF | +5V | +5V | .1uF | GND | GND | - | + | FBSD | 0 | 1 | 2 | 3 | 4 | 5 | 6 | 7 | 8 | 9 | 10 | 11 | 12 | 13 | 14 | 15 | 16 | 17 | 18 | 19 | 20 | 21 | 22 | 23 | GND | .1uF | GND
bPlace: M1 | GND | M2 | FUBARStep v1.2 / Creatded by FUBARLabs and Schmalz Haus / www.fubarlabs.org / www.schmalzhaus.com / www.fubarino.org | M3 | GND | M4
Document: ANALOG INPUTS/3.3V GPIO | FTDI | SERVO OUTPUTS/5V GPIO
214bmp: D:/SmartProjects/Snc/a4_bn_logo2.bmp